# EAGLE design stm32f030f4_qc_trigger (EAGLE 7.6.0)
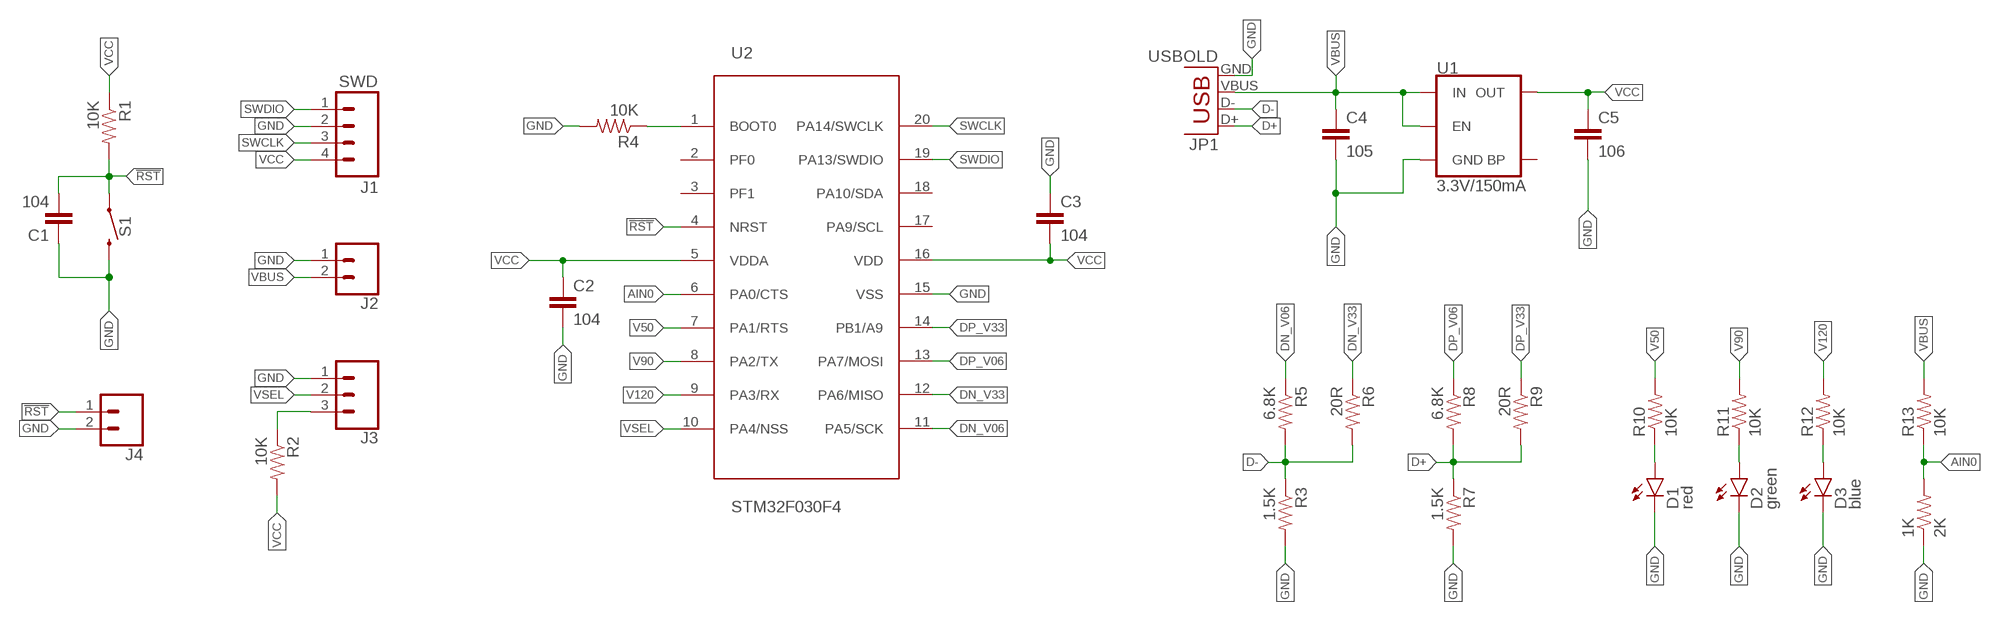
[diagram p0: schematic, sheet 1]

## Parts
1K  2K  RESISTOR0402  [0402-RES]
C1  104  CAP0402-CAP  [0402-CAP]
C2  104  CAP0402-CAP  [0402-CAP]
C3  104  CAP0402-CAP  [0402-CAP]
C4  105  CAP0603-CAP  [0603-CAP]
C5  106  CAP0402-CAP  [0402-CAP]
D1  red  LED-EASY  [LED-0603-EASY]
D2  green  LED-EASY  [LED-0603-EASY]
D3  blue  LED-EASY  [LED-0603-EASY]
J1  SWD  M041X04_NO_SILK  [1X04_NO_SILK]
J2  CONN_025MM  [SCREWTERMINAL-5MM-2]
J3  CONN_031X03_NO_SILK  [1X03_NO_SILK]
J4  CONN_021X02_NO_SILK  [1X02_NO_SILK]
JP1  USBOLD  [USB-MINIB-OLD]
R1  10K  RESISTOR0402  [0402-RES]
R2  10K  RESISTOR0402  [0402-RES]
R3  1.5K  RESISTOR0402  [0402-RES]
R4  10K  RESISTOR0402  [0402-RES]
R5  6.8K  RESISTOR0402  [0402-RES]
R6  20R  RESISTOR0402  [0402-RES]
R7  1.5K  RESISTOR0402  [0402-RES]
R8  6.8K  RESISTOR0402  [0402-RES]
R9  20R  RESISTOR0402  [0402-RES]
R10  10K  RESISTOR0402  [0402-RES]
R11  10K  RESISTOR0402  [0402-RES]
R12  10K  RESISTOR0402  [0402-RES]
R13  10K  RESISTOR0402  [0402-RES]
S1  MOMENTARY-SWITCH-SPST-PTH-6.0MM  [TACTILE_SWITCH_PTH_6.0MM]
U1  3.3V/150mA  V_REG_MIC52053.3V  [SOT23-5]
U2  STM32F030F4  [TSSOP20]

## Nets
!RST: C1.2 J4.1 R1.2 S1.1 U2.4(NRST)
AIN0: 1K.2 R13.1 U2.6(PA0/CTS)
D+: JP1.D+ R7.1 R8.2 R9.2
D-: JP1.D- R3.1 R5.2 R6.2
DN_V06: R5.1 U2.11(PA5/SCK)
DN_V33: R6.1 U2.12(PA6/MISO)
DP_V06: R8.1 U2.13(PA7/MOSI)
DP_V33: R9.1 U2.14(PB1/A9)
GND: 1K.1 C1.1 C2.2 C3.1 C4.2 C5.2 D1.-(C) D2.-(C) D3.-(C) J1.2 J2.1 J3.1 J4.2 JP1.GND R3.2 R4.2 R7.2 S1.3 U1.2(GND) U2.15(VSS)
N$1: J3.3 R2.1
N$4: D1.+(A) R10.1
N$5: R4.1 U2.1(BOOT0)
N$6: D2.+(A) R11.1
N$7: D3.+(A) R12.1
SWCLK: J1.3 U2.20(PA14/SWCLK)
SWDIO: J1.1 U2.19(PA13/SWDIO)
V50: R10.2 U2.7(PA1/RTS)
V90: R11.2 U2.8(PA2/TX)
V120: R12.2 U2.9(PA3/RX)
VBUS: C4.1 J2.2 JP1.VBUS R13.2 U1.1(IN) U1.3(EN)
VCC: C2.1 C3.2 C5.1 J1.4 R1.1 R2.2 U1.5(OUT) U2.5(VDDA) U2.16(VDD)
VSEL: J3.2 U2.10(PA4/NSS)
Unconnected: U1.4(BP) U2.2(PF0) U2.3(PF1) U2.17(PA9/SCL) U2.18(PA10/SDA)

## Library data of the parts
1K R1-R13 = xmgu2008:RESISTOR: Resistor Basic schematic elements and footprints for 0603, 1206, and PTH resistors.
C1-C5 = xmgu2008:CAP: Capacitor Standard 0603 ceramic capacitor, and 0.1" leaded capacitor.
D1-D3 = z_jlc_smt:LED: LEDs Standard schematic elements and footprints for 5mm, 3mm, 1206, and 0603 sized LEDs. 5mm - Spark Fun Electronics SKU : COM-00529 (and others)
J1 = SparkFun-Connectors:M04: Header 4 Standard 4-pin 0.1" header. Use with straight break away headers (SKU : PRT-00116), right angle break away headers (PRT-00553), swiss pins (PRT-00743), machine pins (PRT-00117), and female headers (PRT-00115). Molex polarized connector foot print use with SKU : PRT-08231 with associated crimp pins and housings. 1MM SMD Version SKU: PRT-10208; PROD_ID: CONN-09696
J2 = SparkFun-Connectors:CONN_02: Multi connection point. Often used as Generic Header-pin footprint for 0.1 inch spaced/style header connections On any of the 0.1 inch spaced packages, you can populate with these: Break Away Headers - Straight <https://www.sparkfun.com/products/116> (PRT-00116) Break Away Male Headers - Right Angle <https://www.sparkfun.com/products/553> (PRT-00553) Female Headers <https://www.sparkfun.com/products/115> (PRT-00115) Break Away Headers - Machine Pin <https://www.sparkfun.com/products/117> (PRT-00117) Break Away Female Headers - Swiss Machine Pin <https://www.sparkfun.com/products/743> (PRT-00743) For SCREWTERMINALS and SPRING TERMINALS visit here: Screw Terimnals on SparkFun.com <https://www.sparkfun.com/search/results?term=Screw+Terminals> (5mm/3.5mm/2.54mm spacing) This device is also useful as a general connection point to wire up your design to another part of your project. Our various solder wires solder well into these plated through hole pads. Hook-Up Wire - Assortment (Stranded, 22 AWG) <https://www.sparkfun.com/products/11375> (PRT-11375) Hook-Up Wire - Assortment (Solid Core, 22 AWG) <https://www.sparkfun.com/products/11367> (PRT-11367) View the entire wire category on our website here <https://www.sparkfun.com/categories/141> Special notes: Molex polarized connector foot print use with: PRT-08233 with associated crimp pins and housings. 2.54_SCREWTERM for use with PRT-10571. 3.5mm Screw Terminal footprints for PRT-08084 5mm Screw Terminal footprints for use with PRT-08432; SF_SKU: PRT-08432
J3 = SparkFun-Connectors:CONN_03: Multi connection point. Often used as Generic Header-pin footprint for 0.1 inch spaced/style header connections On any of the 0.1 inch spaced packages, you can populate with these: Break Away Headers - Straight <https://www.sparkfun.com/products/116> (PRT-00116) Break Away Male Headers - Right Angle <https://www.sparkfun.com/products/553> (PRT-00553) Female Headers <https://www.sparkfun.com/products/115> (PRT-00115) Break Away Headers - Machine Pin <https://www.sparkfun.com/products/117> (PRT-00117) Break Away Female Headers - Swiss Machine Pin <https://www.sparkfun.com/products/743> (PRT-00743) Stackable Header - 3 Pin (Female, 0.1") <https://www.sparkfun.com/products/13875> (PRT-13875) For SCREWTERMINALS and SPRING TERMINALS visit here: Screw Terimnals on SparkFun.com <https://www.sparkfun.com/search/results?term=Screw+Terminals> (5mm/3.5mm/2.54mm spacing) This device is also useful as a general connection point to wire up your design to another part of your project. Our various solder wires solder well into these plated through hole pads. Hook-Up Wire - Assortment (Stranded, 22 AWG) <https://www.sparkfun.com/products/11375> (PRT-11375) Hook-Up Wire - Assortment (Solid Core, 22 AWG) <https://www.sparkfun.com/products/11367> (PRT-11367) View the entire wire category on our website here <https://www.sparkfun.com/categories/141> Special notes: Molex polarized connector foot print use with SKU : PRT-08232 with associated crimp pins and housings.
J4 = SparkFun-Connectors:CONN_02: Multi connection point. Often used as Generic Header-pin footprint for 0.1 inch spaced/style header connections On any of the 0.1 inch spaced packages, you can populate with these: Break Away Headers - Straight <https://www.sparkfun.com/products/116> (PRT-00116) Break Away Male Headers - Right Angle <https://www.sparkfun.com/products/553> (PRT-00553) Female Headers <https://www.sparkfun.com/products/115> (PRT-00115) Break Away Headers - Machine Pin <https://www.sparkfun.com/products/117> (PRT-00117) Break Away Female Headers - Swiss Machine Pin <https://www.sparkfun.com/products/743> (PRT-00743) For SCREWTERMINALS and SPRING TERMINALS visit here: Screw Terimnals on SparkFun.com <https://www.sparkfun.com/search/results?term=Screw+Terminals> (5mm/3.5mm/2.54mm spacing) This device is also useful as a general connection point to wire up your design to another part of your project. Our various solder wires solder well into these plated through hole pads. Hook-Up Wire - Assortment (Stranded, 22 AWG) <https://www.sparkfun.com/products/11375> (PRT-11375) Hook-Up Wire - Assortment (Solid Core, 22 AWG) <https://www.sparkfun.com/products/11367> (PRT-11367) View the entire wire category on our website here <https://www.sparkfun.com/categories/141> Special notes: Molex polarized connector foot print use with: PRT-08233 with associated crimp pins and housings. 2.54_SCREWTERM for use with PRT-10571. 3.5mm Screw Terminal footprints for PRT-08084 5mm Screw Terminal footprints for use with PRT-08432
JP1 = xmgu2008:USB: USB Connectors USB-B-PTH is fully proven SKU : PRT-00139/CONN-08278 USB-miniB is fully proven SKU : PRT-00587 USB-A-PCB is untested. USB-A-H is throughly reviewed, but untested. Spark Fun Electronics SKU : PRT-00437 USB-B-SMT is throughly reviewed, but untested. Needs silkscreen touching up. USB-A-S has not been used/tested USB-MB-H has not been used/tested USB-MICROB has been used. CONN-09505
S1 = SparkFun-Switches:MOMENTARY-SWITCH-SPST: Momentary Switch (Pushbutton) - SPST Normally-open (NO) SPST momentary switches (buttons, pushbuttons). Variants PTH-12MM - 12mm square, through-hole Momentary Pushbutton Switch - 12mm Square <https://www.sparkfun.com/products/9190> (COM-09190) PTH-6.0MM, PTH-6.0MM-KIT - 6.0mm square, through-hole Mini Pushbutton Switch <https://www.sparkfun.com/products/97> (COM-00097) KIT package intended for soldering kit's - only one side of pads' copper is exposed. PTH-RIGHT-ANGLE-KIT - Right-angle, through-hole Right Angle Tactile Button <https://www.sparkfun.com/products/10791> - Used on SparkFun BigTime Watch Kit <https://www.sparkfun.com/products/11734> SMD-12MM - 12mm square, surface-mount Tactile Button - SMD (12mm) <https://www.sparkfun.com/products/12993> (COM-12993) Used on SparkFun PicoBoard <https://www.sparkfun.com/products/11888> SMD-4.5MM - 4.5mm Square Trackball Switch Used on SparkFun Blackberry Trackballer Breakout <https://www.sparkfun.com/products/13169> SMD-4.6MMX2.8MM - 4.60mm x 2.80mm, surface mount Used on SparkFun SAMD21 Mini Breakout <https://www.sparkfun.com/products/13664> SMD-5.2MM, SMD-5.2-REDUNDANT - 5.2mm square, surface-mount Mini Pushbutton Switch - SMD <https://www.sparkfun.com/products/8720> (COM-08720) Used on Arduino Pro Mini <https://www.sparkfun.com/products/11114> REDUNDANT package connects both switch circuits together SMD-6.0X3.5MM - 6.0 x 3.5mm, surface mount Momentary Reset Switch SMD <https://www.sparkfun.com/products/8229> (COM-08229) SMD-6.2MM-TALL - 6.2mm square, surface mount Tactile Button - SMD (6mm) <https://www.sparkfun.com/products/12992> Used on SparkFun Digital Sandbox <https://www.sparkfun.com/products/12651> SMD-RIGHT-ANGLE - Right-angle, surface mount Used on SparkFun Block for Intel® Edison - Arduino <https://www.sparkfun.com/products/13036>; PROD_ID: SWCH-08441; SF_SKU: COM-00097
U1 = SparkFun-IC-Power:V_REG_MIC5205: V_REG MIC5205 Standard 3.3V, 5V, and Adjustable 150mA LDO voltage regulator in SOT-23 layout. Micrel part MIC5205. BP (by-pass) pin is used to lower output noise with 470pF cap, may be left open. On the adjustable version BP is used to set output.; PROD_ID: VREG-00822
U2 = xmgu2008:STM32F030F4

## Board
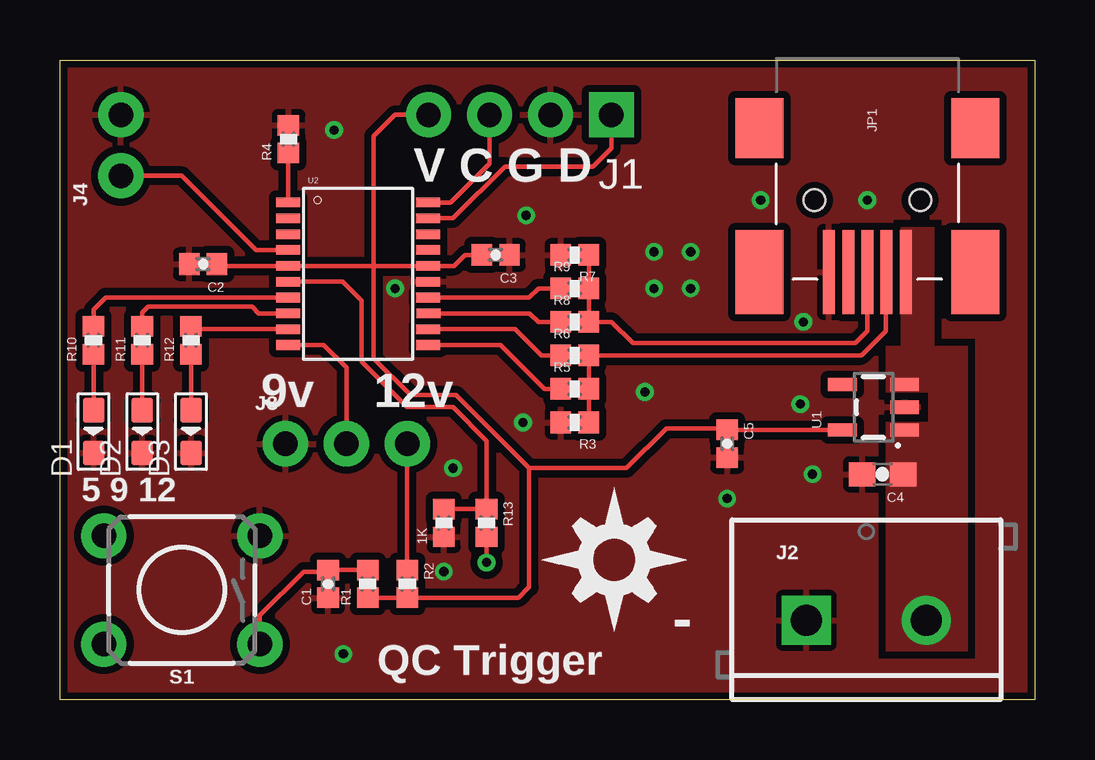
[diagram p1: board, top side]
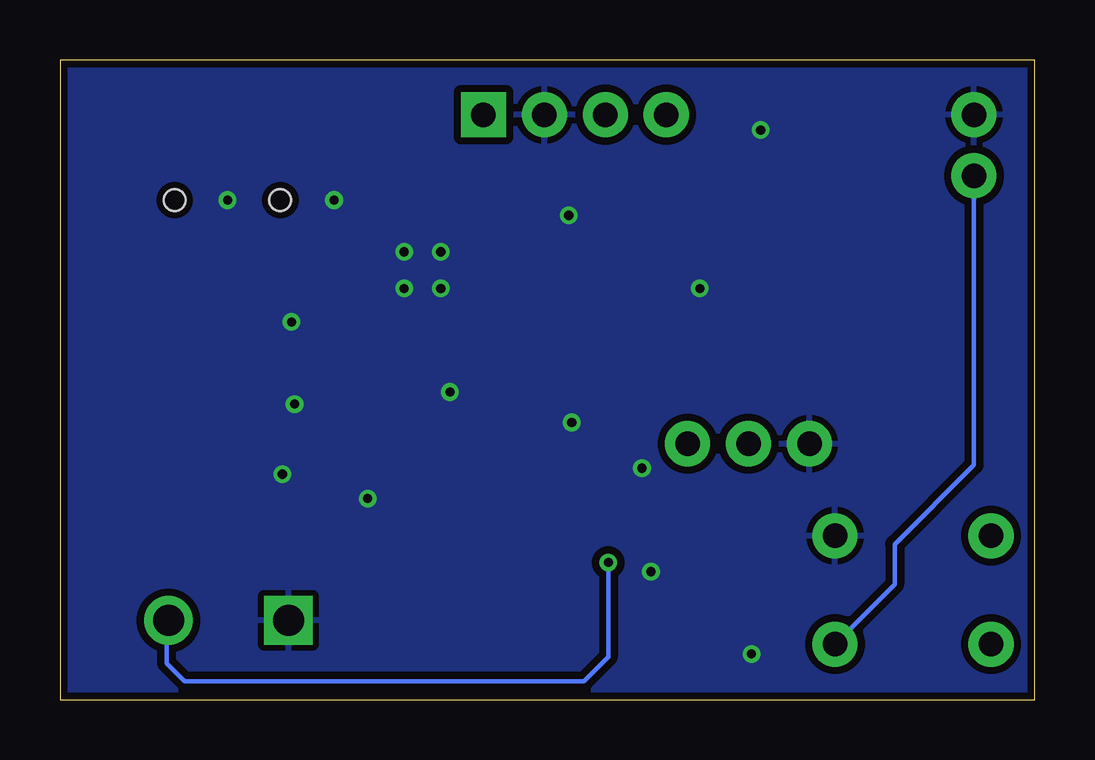
[diagram p2: board, bottom side, seen from below]

Size 40.64 x 26.67 mm. Coordinates in mm from the lower left corner, seen from the top.
Outline: 0,0 0,26.67 40.64,26.67 40.64,0 0,0
Copper layers (1*16): Top 0.035mm / dielectric 1.5mm / Bottom 0.035mm
Design rules "SparkFun-2-layer-TIGHT": minimum track width 7mil, minimum drill 15mil, track to track 7mil, track to pad 7mil, pad to pad 7mil, via to via 7mil, smd to smd 7mil, copper to edge 7mil, drill to drill 7mil, minimum pad ring 7mil, minimum via ring 7mil, stop-mask expansion 4mil, vias tented up to drill 20mil, thermal gap 10mil

### Footprints (pad centres in the part's own frame; a part is rotated, then mirrored left to right if it is on the bottom)
0402-RES = smd 0.85 x 0.9: 1 -0.58,0; 2 0.58,0
0402-CAP = smd 0.85 x 0.9: 1 -0.58,0; 2 0.58,0
0603-CAP = smd 1.1 x 1: 1 -0.85,0; 2 0.85,0
LED-0603-EASY = smd 1.016 x 0.889: + 0.889,0; - -0.889,0
1X04_NO_SILK = drill 1.016 pad 1.88 square: 1 0,0 | drill 1.016 pad 1.88: 2 2.54,0; 3 5.08,0; 4 7.62,0
SCREWTERMINAL-5MM-2 = drill 1.3 pad 2.032 square: 1 0,0 | drill 1.3 pad 2.032: 2 5,0
1X03_NO_SILK = drill 1.016 pad 1.88: 1 0,0; 2 2.54,0; 3 5.08,0
1X02_NO_SILK = drill 1.016 pad 1.88: 1 0,0; 2 2.54,0
USB-MINIB-OLD = smd 2.5 x 2: 1 -3,-4.5; 2 -3,4.5 | smd 3.5 x 2: 3 3,-4.5; 4 3,4.5 | smd 3.5 x 0.5: D+ 3,0; D- 3,0.8; GND 3,-1.6; ID 3,-0.8; VBUS 3.01,1.61 | hole 0.9: 0,2.2; 0,-2.2
TACTILE_SWITCH_PTH_6.0MM = drill 1.016 pad 1.88: 1 -3.251,2.261; 2 3.251,2.261; 3 -3.251,-2.261; 4 3.251,-2.261
SOT23-5 = smd 0.55 x 1.2: 1 -0.95,-1.3; 2 0,-1.3; 3 0.95,-1.3; 4 0.95,1.3; 5 -0.95,1.3
TSSOP20 = smd 1 x 0.4: 1 -2.937,2.693; 2 -2.937,2.032; 3 -2.937,1.372; 4 -2.937,0.712; 5 -2.937,0.051; 6 -2.937,-0.609; 7 -2.937,-1.27; 8 -2.943,-1.93; 9 -2.937,-2.59; 10 -2.937,-3.251; 11 2.905,-3.251; 12 2.905,-2.59; 13 2.911,-1.93; 14 2.905,-1.27; 15 2.905,-0.609; 16 2.905,0.051; 17 2.905,0.712; 18 2.905,1.372; 19 2.905,2.032; 20 2.905,2.693

### Placement (x,y rotation side)
1K  16,7.37 90 top
C1  11.18,4.83 90 top
C2  5.97,18.16 180 top
C3  18.16,18.54 180 top
C4  34.29,9.4 180 top
C5  27.81,10.67 270 top
D1  1.4,11.18 90 top
D2  3.43,11.18 90 top
D3  5.46,11.18 90 top
J1  22.99,24.38 180 top
J2  31.11,3.3 0 top
J3  9.4,10.67 0 top
J4  2.54,21.84 90 top
JP1  33.66,20.83 270 top
R1  12.83,4.83 90 top
R2  14.48,4.83 270 top
R3  21.46,11.56 180 top
R4  9.53,23.37 90 top
R5  21.46,12.95 0 top
R6  21.46,14.35 0 top
R7  21.46,18.54 180 top
R8  21.46,15.75 0 top
R9  21.46,17.14 0 top
R10  1.4,14.99 90 top
R11  3.43,14.99 90 top
R12  5.46,14.99 90 top
R13  17.78,7.37 270 top
S1  5.08,4.57 180 top
U1  33.91,12.19 90 top
U2  12.45,18.03 0 top
U$1  [DIYNOVA_LOGO]  20.07,2.79 0 top

### Tracks (layer width: path | path; a pad name or v marks a point on that pad's centre or on a via)
!RST
  Top 0.178: U2.4 8.18,18.75 5.08,21.84 J4.1 | S1.1 8.33,3.5 10.16,5.33 11.1,5.33 C1.2 R1.2
  Bottom 0.178: J4.1 2.54,9.78 5.84,6.48 5.84,4.8 S1.1
AIN0
  Top 0.178: U2.6 11.79,17.43 12.57,16.64 12.57,14.1 14.48,12.19 16.38,12.19 17.78,10.79 R13.1 1K.2
D+
  Top 0.178: R7.1 R9.2 R8.2 22.99,15.75 23.88,14.86 33.15,14.86 33.66,15.37 JP1.D+
D-
  Top 0.178: R3.1 R5.2 R6.2 33.4,14.35 34.42,15.37 34.42,17.79 JP1.D-
DN_V06
  Top 0.178: U2.11 18.36,14.78 20.19,12.95 R5.1
DN_V33
  Top 0.178: U2.12 18.97,15.44 20.07,14.35 R6.1
DP_V06
  Top 0.178: U2.13 19.58,16.1 19.94,15.75 R8.1
DP_V33
  Top 0.178: U2.14 19.56,16.76 19.94,17.14 R9.1
GND  (via drill 0.38)
  other vias: 19.43,20.19 27.81,8.38 11.43,23.75 11.81,1.91 26.29,17.14 30.99,15.75 24.38,12.83 16.38,9.65 29.21,20.83 33.66,20.83 26.29,18.67 24.77,18.67 24.77,17.14 31.37,9.4 30.86,12.32 19.3,11.56 13.97,17.14 16,5.33
  pour Bottom (isolate 0.305): 0,0 0,26.67 40.64,26.67 40.64,0
  pour Top (isolate 0.305, rank 3): 0,0 0,26.67 40.64,26.67 40.64,0
N$1
  Top 0.178: R2.1 J3.3
N$4
  Top 0.178: R10.1 D1.+
N$5
  Top 0.178: U2.1 9.51,22.77 R4.1
N$6
  Top 0.178: R11.1 D2.+
N$7
  Top 0.178: R12.1 D3.+
SWCLK
  Top 0.178: U2.20 16.28,20.73 17.91,22.35 J1.3
SWDIO
  Top 0.178: U2.19 16.38,20.07 18.54,22.23 22.23,22.23 22.99,22.99 J1.1
V50
  Top 0.178: U2.7 1.91,16.76 1.4,16.26 R10.2
V90
  Top 0.178: U2.8 8.28,16.1 8,16.38 3.68,16.38 3.43,16.13 R11.2
V120
  Top 0.178: U2.9 5.58,15.44 R12.2
VBUS  (via drill 0.38)
  Top 0.178: R13.2 v17.78,5.71
  Bottom 0.178: v17.78,5.71 17.78,1.78 18.8,0.76 35.43,0.76 36.2,1.52 36.2,3.22 J2.2
  pour Top (isolate 0.305, no thermals): 35.05,19.68 35.05,14.73 34.42,14.73 34.42,12.83 36.2,12.83 36.2,11.56 34.42,11.56 34.42,2.03 37.85,2.03 37.85,14.73 36.45,14.73 36.45,19.68
VCC
  Top 0.178: C2.1 6.62,18.09 U2.5 13.08,18.09 | R1.1 R2.2 19.11,4.25 19.56,4.7 19.56,9.65 | 19.56,9.65 16.51,12.7 14.61,12.7 13.08,14.22 13.08,18.09 | 19.56,9.65 23.62,9.65 25.27,11.3 27.76,11.3 C5.1 U1.5 | C3.2 16.89,18.54 16.43,18.09 U2.16 13.08,18.09 | 13.08,18.09 13.08,23.5 13.97,24.38 J1.4
VSEL
  Top 0.178: J3.2 11.94,13.84 11,14.78 U2.10

### Text on the board
tPlace: V C G D | 9v | 12v | 5 9 12 | - | QC Trigger